# EAGLE design D2Power (EAGLE 5.11)
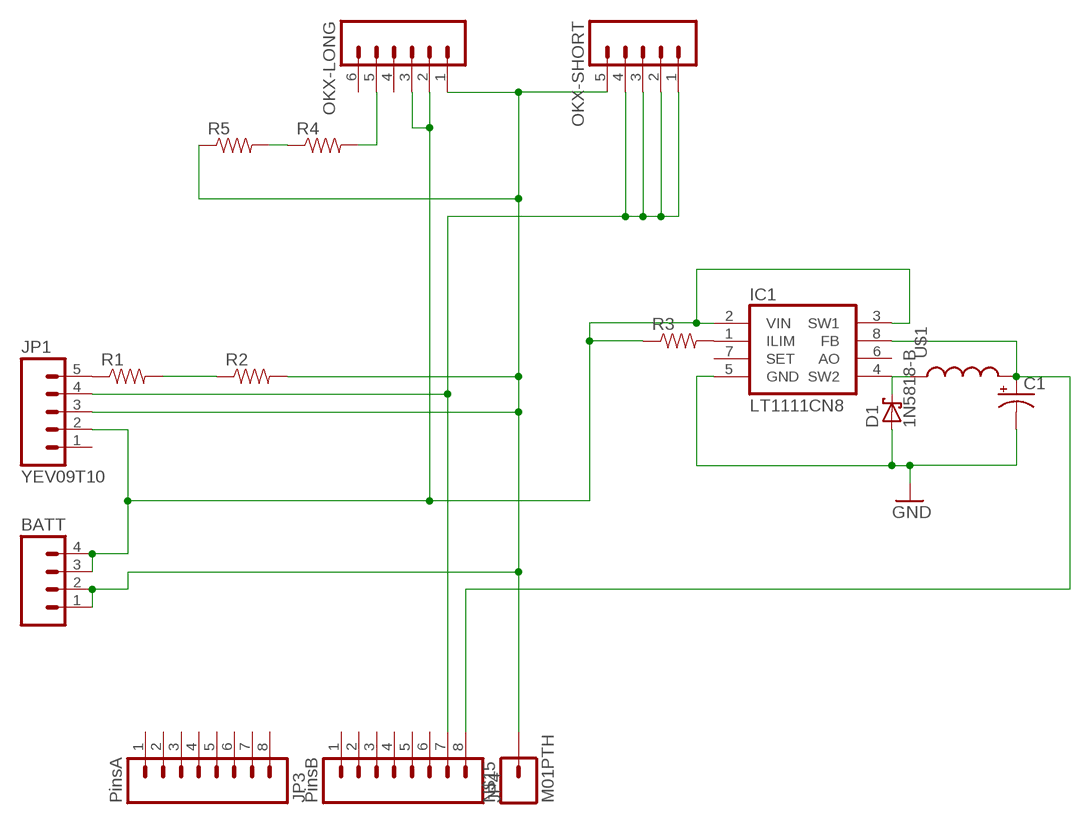
[diagram p0: schematic, sheet 1]

## Parts
BATT  M04PTH  [1X04]
C1  CAP_POLPTH2  [CPOL-RADIAL-10UF-25V]
D1  1N5818-B  [DO41-7.6]
IC1  LT1111CN8  [DIL08]
JP1  YEV09T10  M05PTH  [1X05]
JP3  PinsA  M08  [1X08]
JP4  PinsB  M08  [1X08]
N$15  M01PTH  [1X01]
OKX-LONG  M06SIP  [1X06]
OKX-SHORT  M05PTH  [1X05]
R1  RESISTORPTH1  [AXIAL-0.3]
R2  RESISTORPTH1  [AXIAL-0.3]
R3  RESISTORPTH1  [AXIAL-0.3]
R4  RESISTORPTH1  [AXIAL-0.3]
R5  RESISTORPTH1  [AXIAL-0.3]
U$1  INDUCTORCR75  [CR75]

## Nets
GND: BATT.1 BATT.2 C1.2(-) D1.A IC1.5(GND) JP1.3 N$15.1 OKX-LONG.1 OKX-SHORT.5 R2.P$2 R5.P$1
N$2: C1.1(+) IC1.8(FB) JP4.8 U$1.P$2
N$3: R1.P$2 R2.P$1
N$4: JP1.5 R1.P$1
N$5: R4.P$1 R5.P$2
N$6: D1.C IC1.4(SW2) U$1.P$1
N$9: IC1.1(ILIM) R3.P$2
N$12: OKX-LONG.5 R4.P$2
VBATT: BATT.3 BATT.4 IC1.2(VIN) IC1.3(SW1) JP1.2 OKX-LONG.2 OKX-LONG.3 R3.P$1
VLED: JP1.4 JP4.7 OKX-SHORT.1 OKX-SHORT.2 OKX-SHORT.3 OKX-SHORT.4
Unconnected: IC1.6(AO) IC1.7(SET) JP1.1 JP3.1 JP3.2 JP3.3 JP3.4 JP3.5 JP3.6 JP3.7 JP3.8 JP4.1 JP4.2 JP4.3 JP4.4 JP4.5 JP4.6 OKX-LONG.4 OKX-LONG.6

## Library data of the parts
BATT = SparkFun:M04: Header 4 Standard 4-pin 0.1" header. Use with straight break away headers (SKU : PRT-00116), right angle break away headers (PRT-00553), swiss pins (PRT-00743), machine pins (PRT-00117), and female headers (PRT-00115). Molex polarized connector foot print use with SKU : PRT-08231 with associated crimp pins and housings.
C1 = SparkFun:CAP_POL: Capacitor Polarized These are standard SMD and PTH capacitors. Normally 10uF, 47uF, and 100uF in electrolytic and tantalum varieties. Always verify the external diameter of the through hole cap, it varies with capacity, voltage, and manufacturer. The EIA devices should be standard.
D1 = diode:1N581*: 1.0A SCHOTTKY BARRIER RECTIFIER Source: http://www.diodes.com/datasheets/ds23001.pdf
IC1 = linear-technology-2:LT1111*: Micropower DC/DC Converter Adjustable and Fixed 5V, 12V
JP1 OKX-SHORT = SparkFun:M05: Header 5 Standard 5-pin 0.1" header. Use with straight break away headers (SKU : PRT-00116), right angle break away headers (PRT-00553), swiss pins (PRT-00743), machine pins (PRT-00117), and female headers (PRT-00115). Molex polarized connector foot print use with SKU : PRT-08230 with associated crimp pins and housings.
JP3 JP4 = SparkFun:M08: Header 8 Standard 8-pin 0.1" header. Use with straight break away headers (SKU : PRT-00116), right angle break away headers (PRT-00553), swiss pins (PRT-00743), machine pins (PRT-00117), and female headers (PRT-00115).
N$15 = SparkFun:M01: Header 1 Standard 1-pin 0.1" header. Use with straight break away headers (SKU : PRT-00116), right angle break away headers (PRT-00553), swiss pins (PRT-00743), machine pins (PRT-00117), and female headers (PRT-00115).
OKX-LONG = SparkFun:M06: Header 6 Standard 6-pin 0.1" header. Use with straight break away headers (SKU : PRT-00116), right angle break away headers (PRT-00553), swiss pins (PRT-00743), machine pins (PRT-00117), and female headers (PRT-00115). Molex polarized connector foot print use with SKU : PRT-08094 with associated crimp pins and housings. NOTES ON THE VARIANTS LOCK and LOCK_LONGPADS... This footprint was designed to help hold the alignment of a through-hole component (i.e. 6-pin header) while soldering it into place. You may notice that each hole has been shifted either up or down by 0.005 of an inch from it's more standard position (which is a perfectly straight line). This slight alteration caused the pins (the squares in the middle) to touch the edges of the holes. Because they are alternating, it causes a "brace" to hold the component in place. 0.005 has proven to be the perfect amount of "off-center" position when using our standard breakaway headers. Although looks a little odd when you look at the bare footprint, once you have a header in there, the alteration is very hard to notice. Also, if you push a header all the way into place, it is covered up entirely on the bottom side. This idea of altering the position of holes to aid alignment will be further integrated into the Sparkfun Library for other footprints. It can help hold any component with 3 or more connection pins.
R1-R5 = SparkFun:RESISTOR: Resistor Basic schematic elements and footprints for 0603, 1206, and PTH 1/10th watt (small) resistors.
U$1 = SparkFun:INDUCTOR: Inductors Basic Inductor/Choke - 0603 and 1206. Footprints are not proven and vary greatly between part numbers.

## Net classes
0 default: width 0.762 mm, drill 0.508 mm, clearance 0.203 mm

## Board
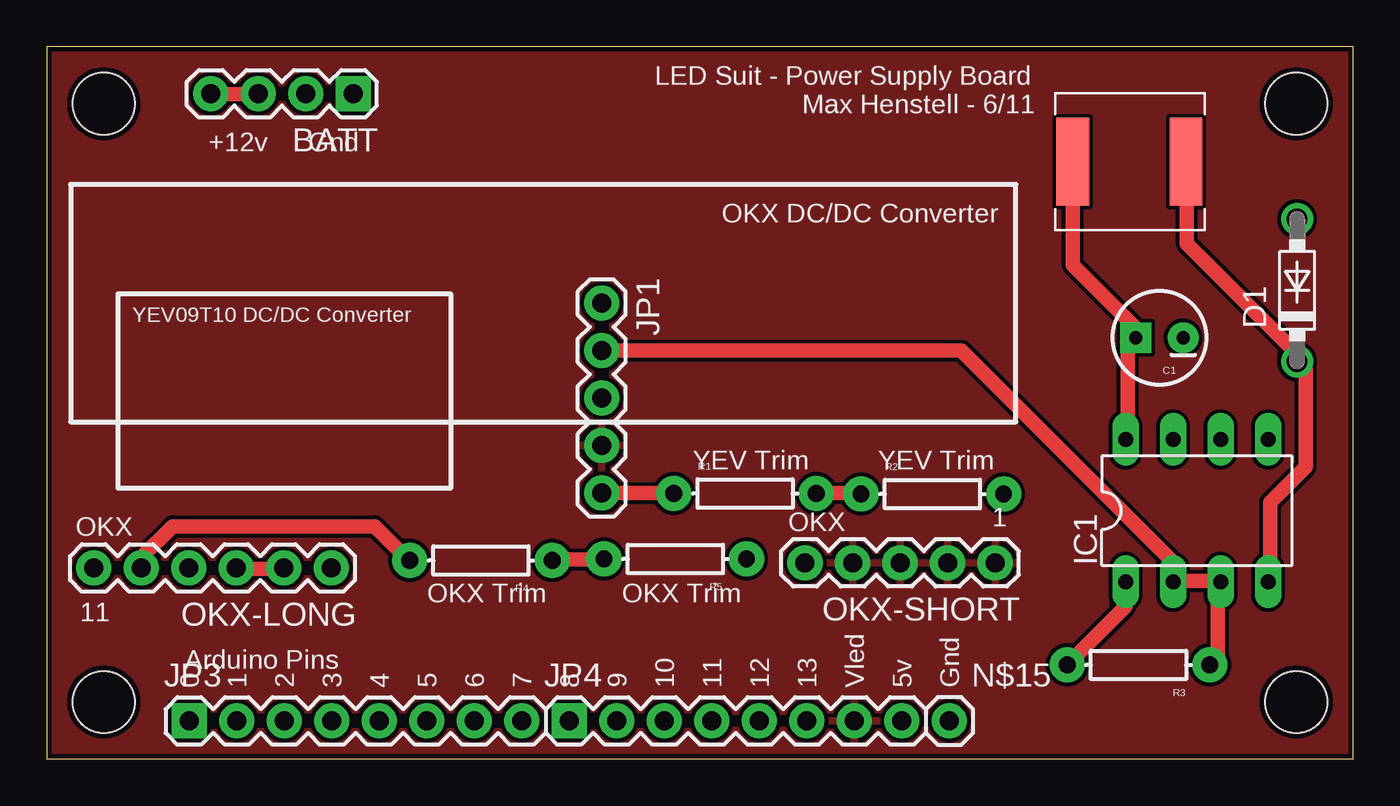
[diagram p1: board, top side]
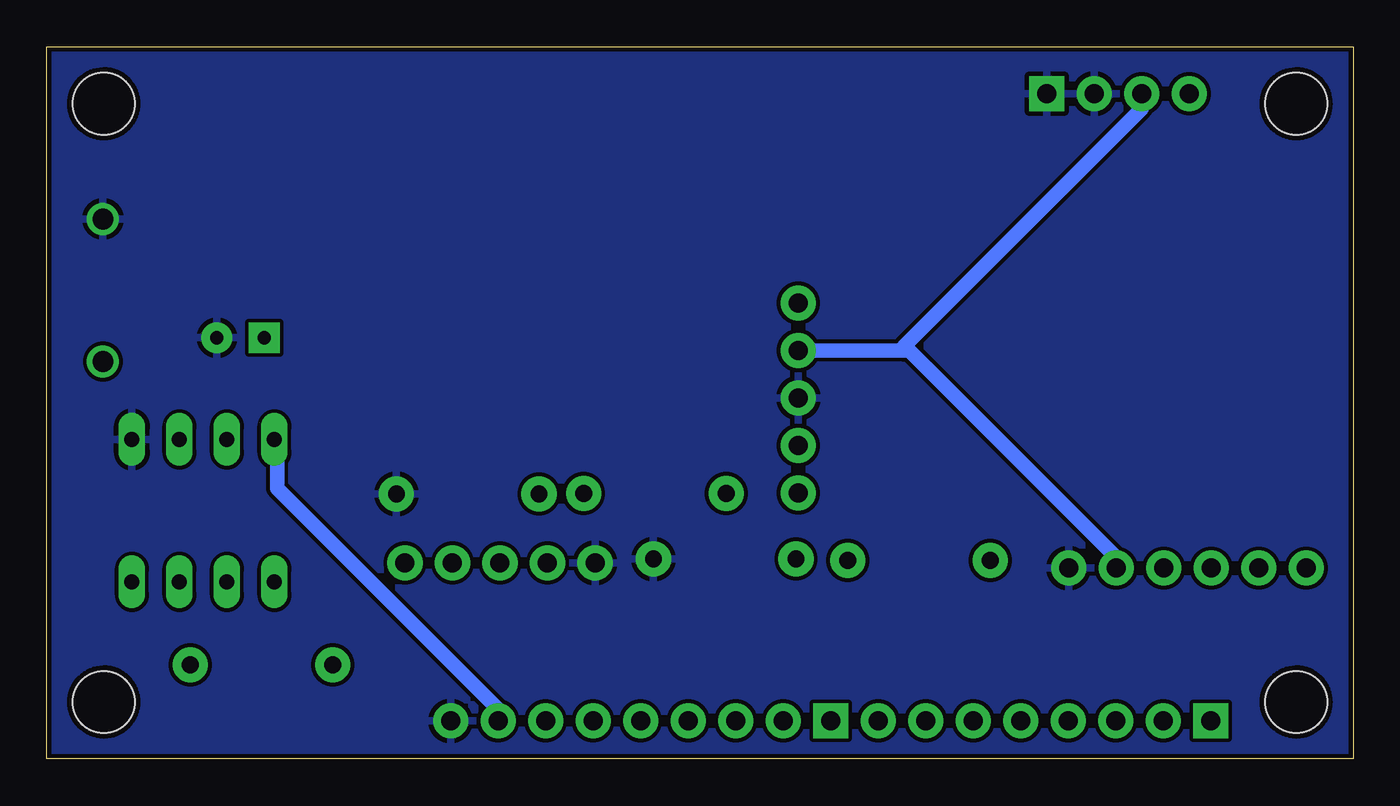
[diagram p2: board, bottom side, seen from below]

Size 69.85 x 38.1 mm. Coordinates in mm from the lower left corner, seen from the top.
Outline: 0,0 69.85,0 69.85,38.1 0,38.1 0,0
Copper layers (1*16): Top 0.035mm / dielectric 1.5mm / Bottom 0.035mm
Design rules "SparkFun": minimum track width 8mil, minimum drill 20mil, track to track 8mil, track to pad 8mil, pad to pad 8mil, via to via 8mil, smd to smd 8mil, copper to edge 10mil, drill to drill 8mil, minimum pad ring 12mil, minimum via ring 10mil, stop-mask expansion 4mil, vias tented up to drill 25mil, thermal gap 10mil

### Footprints (pad centres in the part's own frame; a part is rotated, then mirrored left to right if it is on the bottom)
1X04 = drill 1.016 pad 1.88 square: 1 0,0 | drill 1.016 pad 1.88 round: 2 2.54,0; 3 5.08,0; 4 7.62,0
CPOL-RADIAL-10UF-25V = drill 0.7 pad 1.651 square: 1 1.27,0 | drill 0.7 pad 1.651 round: 2 -1.27,0
DO41-7.6 = drill 1.1 pad 1.7 round: A 3.81,0; C -3.81,0
DIL08 = drill 0.813 long: 1 -3.81,-3.81; 2 -1.27,-3.81; 3 1.27,-3.81; 4 3.81,-3.81; 5 3.81,3.81; 6 1.27,3.81; 7 -1.27,3.81; 8 -3.81,3.81
1X05 = drill 1.016 pad 1.88 round: 1 0,0; 2 2.54,0; 3 5.08,0; 4 7.62,0; 5 10.16,0
1X08 = drill 1.016 pad 1.88 square: 1 0,0 | drill 1.016 pad 1.88 round: 2 2.54,0; 3 5.08,0; 4 7.62,0; 5 10.16,0; 6 12.7,0; 7 15.24,0; 8 17.78,0
1X01 = drill 1.016 pad 1.88 round: 1 0,0
1X06 = drill 1.016 pad 1.88 round: 1 0,0; 2 2.54,0; 3 5.08,0; 4 7.62,0; 5 10.16,0; 6 12.7,0
AXIAL-0.3 = drill 0.9 pad 1.88 round: P$1 -3.81,0; P$2 3.81,0
CR75 = smd 1.75 x 4.7: P$1 0,0; P$2 6.05,0
STAND-OFF = hole 3.302: 0,0

### Placement (x,y rotation side)
BATT  16.38,35.59 180 top
C1  59.49,22.53 180 top
D1  66.85,25.07 90 top
IC1  61.49,13.28 0 top
JP1  29.67,24.38 270 top
JP3  7.62,2.03 0 top
JP4  27.94,2.03 0 top
N$15  48.26,2.03 0 top
OKX-LONG  15.21,10.21 180 top
OKX-SHORT  50.7,10.49 180 top
R1  37.34,14.2 0 top
R2  47.35,14.17 0 top
R3  58.37,5.03 180 top
R4  23.22,10.62 180 top
R5  33.6,10.69 180 top
U$1  60.91,31.95 180 top
U$17  [STAND-OFF]  3.05,3.05 0 top
U$18  [STAND-OFF]  3.05,35.05 0 top
U$19  [STAND-OFF]  66.8,35.05 0 top
U$20  [STAND-OFF]  66.8,3.05 0 top

### Tracks (layer width: path | path; a pad name or v marks a point on that pad's centre or on a via)
GND
  pour Bottom: 0,37.85 69.85,37.85 69.85,0 0,0
N$2
  Top 0.762: IC1.8 57.78,17.14 57.78,22.1 C1.1 58.42,22.86 54.86,26.42 54.86,31.88 U$1.P$2
  Bottom 0.762: JP4.8 45.72,2.67 57.53,14.48 57.53,16.89 57.66,17.02 IC1.8
N$3
  Top 0.762: R1.P$2 41.15,14.22 43.43,14.22 R2.P$1
N$4
  Top 0.762: JP1.5 33.53,14.22 R1.P$1
N$5
  Top 0.762: R4.P$1 27.05,10.67 29.72,10.67 R5.P$2
N$6
  Top 0.762: IC1.4 65.41,9.53 65.41,13.72 67.31,15.62 67.31,20.83 66.93,21.21 D1.C 66.93,21.59 60.96,27.56 60.96,31.88 U$1.P$1
N$9
  Top 0.762: IC1.1 57.66,9.4 57.66,8.13 R3.P$2
N$12
  Top 0.762: OKX-LONG.5 5.08,10.29 5.08,10.79 6.73,12.45 17.53,12.45 19.3,10.67 R4.P$2
VBATT
  Top 0.762: R3.P$1 62.1,5.08 62.61,5.59 62.61,9.14 IC1.3 62.74,9.53 60.33,9.53 IC1.2 60.33,9.91 60.33,10.41 48.9,21.84 JP1.2 | BATT.4 8.76,35.56 11.3,35.56 BATT.3 | OKX-LONG.3 10.16,10.16 12.57,10.16 OKX-LONG.2
  Bottom 0.762: 24,21.84 23.75,21.84 12.7,10.79 12.7,10.29 OKX-LONG.2 | 24,21.84 JP1.2 | BATT.3 11.3,34.8 24,22.1 24,21.84
VLED
  pour Top: 0.25,37.85 69.85,37.85 69.85,0 0.25,0

### Text on the board
tPlace: LED Suit - Power Supply Board | Max Henstell - 6/11 | +12v | Gnd | OKX DC/DC Converter | YEV09T10 DC/DC Converter | YEV Trim | YEV Trim | OKX | OKX | 1 | OKX Trim | OKX Trim | 11 | Arduino Pins | 0 | 1 | 2 | 3 | 4 | 5 | 6 | 7 | 8 | 9 | 10 | 11 | 12 | 13 | Vled | 5v | Gnd